# EAGLE design IDS_ADC (EAGLE 9.5.0)
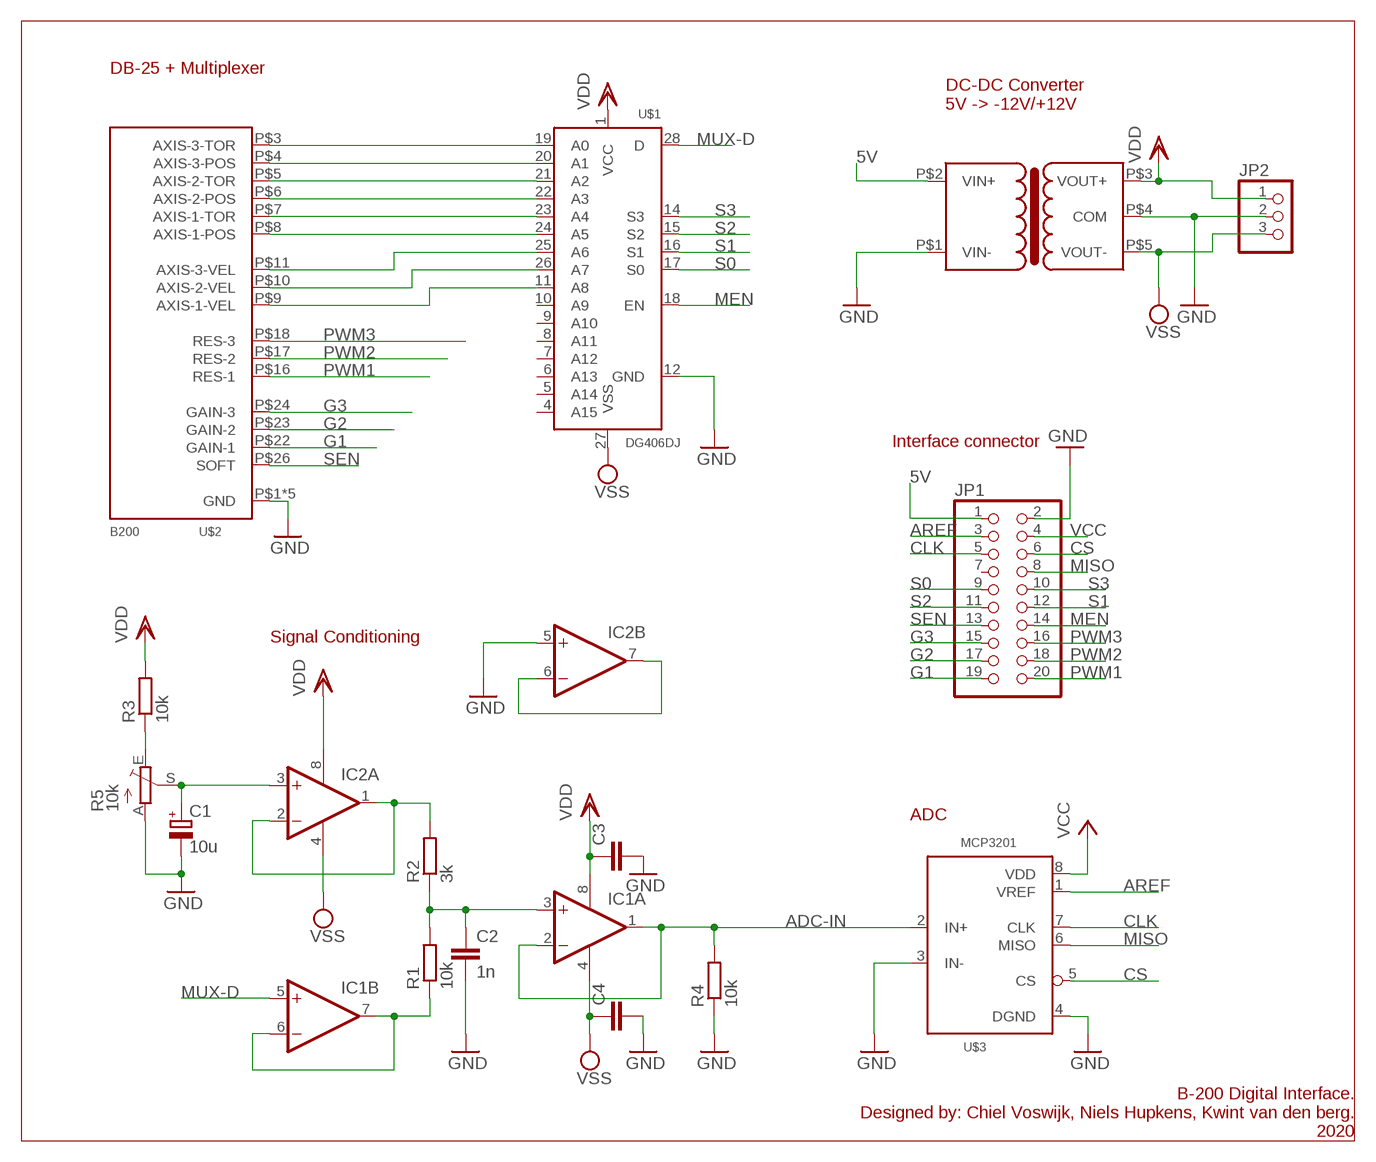
[diagram p0: schematic, sheet 1]

## Parts
C1  10u  CPOL-EUE2.5-7  [E2,5-7]
C2  1n  C-EUC1206  [C1206]
C3  C-EUC1206  [C1206]
C4  C-EUC1206  [C1206]
IC1  NE5532N  [DIL08]
IC2  NE5532N  [DIL08]
JP1  PINHD-2X10  [2X10]
JP2  PINHD-1X3  [1X03]
R1  10k  R-EU_0207/7  [0207/7]
R2  3k  R-EU_0207/7  [0207/7]
R3  10k  R-EU_0207/7  [0207/7]
R4  10k  R-EU_0207/7  [0207/7]
R5  10k  TRIM_EU-RJ9W  [RJ9W]
U$1  DG406DJ  [DIL28-6]
U$2  B200  [PARALLEL]
U$3  MCP3201  [DIL08]
U$4  TRACO-DR-NE  [TRACO-DCDC-SIP6]

## Nets
5V: JP1.1 U$4.P$2(VIN+)
ADC-IN: IC1.1(A:OUT) IC1.2(A:-IN) R4.2 U$3.2(IN+)
AREF: JP1.3 U$3.1(VREF)
CLK: JP1.5 U$3.7(CLK)
CS: JP1.6 U$3.5(CS)
G1: JP1.19 U$2.P$22(GAIN-1)
G2: JP1.17 U$2.P$23(GAIN-2)
G3: JP1.15 U$2.P$24(GAIN-3)
GND: C1.- C2.2 C3.2 C4.2 IC2.5(B:+IN) JP1.2 JP2.2 R4.1 R5.A U$1.12(GND) U$2.P$1(GND) U$2.P$2(GND) U$2.P$19(GND) U$2.P$20(GND) U$2.P$21(GND) U$3.3(IN-) U$3.4(DGND) U$4.P$1(VIN-) U$4.P$4(COM)
MEN: JP1.14 U$1.18(EN)
MISO: JP1.8 U$3.6(MISO)
MUX-D: IC1.5(B:+IN) U$1.28(D)
N$1: IC2.6(B:-IN) IC2.7(B:OUT)
N$2: U$1.19(A0) U$2.P$3(AXIS-3-TOR)
N$3: C2.1 IC1.3(A:+IN) R1.2 R2.1
N$4: U$1.20(A1) U$2.P$4(AXIS-3-POS)
N$5: IC1.6(B:-IN) IC1.7(B:OUT) R1.1
N$6: U$1.21(A2) U$2.P$5(AXIS-2-TOR)
N$7: IC2.1(A:OUT) IC2.2(A:-IN) R2.2
N$8: C1.+ IC2.3(A:+IN) R5.S
N$9: U$1.22(A3) U$2.P$6(AXIS-2-POS)
N$10: U$1.23(A4) U$2.P$7(AXIS-1-TOR)
N$11: U$1.24(A5) U$2.P$8(AXIS-1-POS)
N$12: U$1.25(A6) U$2.P$11(AXIS-3-VEL)
N$13: U$1.26(A7) U$2.P$10(AXIS-2-VEL)
N$14: U$1.11(A8) U$2.P$9(AXIS-1-VEL)
N$15: R3.1 R5.E
PWM1: JP1.20 U$2.P$16(RES-1)
PWM2: JP1.18 U$2.P$17(RES-2)
PWM3: JP1.16 U$2.P$18(RES-3)
S0: JP1.9 U$1.17(S0)
S1: JP1.12 U$1.16(S1)
S2: JP1.11 U$1.15(S2)
S3: JP1.10 U$1.14(S3)
SEN: JP1.13 U$2.P$26(SOFT)
VCC: JP1.4 U$3.8(VDD)
VDD: C3.1 IC1.8(P:V+) IC2.8(P:V+) JP2.1 R3.2 U$1.1(VCC) U$4.P$3(VOUT+)
VSS: C4.1 IC1.4(P:V-) IC2.4(P:V-) JP2.3 U$1.27(VSS) U$4.P$5(VOUT-)
Unconnected: JP1.7 U$1.4(A15) U$1.5(A14) U$1.6(A13) U$1.7(A12) U$1.8(A11) U$1.9(A10) U$1.10(A9)

## Notes on the sheet
- DB-25 + Multiplexer
- DC-DC Converter
  5V -> -12V/+12V
- Interface connector
- Signal Conditioning
- ADC
- B-200 Digital Interface.
  Designed by: Chiel Voswijk, Niels Hupkens, Kwint van den berg.
  2020

## Library data of the parts
C1 = rcl:CPOL-EU: POLARIZED CAPACITOR, European symbol; SPICEPREFIX: C
C2-C4 = rcl:C-EU: CAPACITOR, European symbol; SPICEPREFIX: C
IC1 IC2 = linear:NE5532: AUDIO AMPLIFIER
JP1 = pinhead:PINHD-2X10: PIN HEADER
JP2 = pinhead:PINHD-1X3: PIN HEADER
R1-R4 = rcl:R-EU_: RESISTOR, European symbol; SPICEPREFIX: R
R5 = pot:TRIM_EU-: POTENTIOMETER
U$1 = FHD-Actives:DG406
U$2 = FHD-Connectors:B200
U$3 = FHD-Actives:MCP3201
U$4 = FHD-POWER:TRACO-DR-NE

## Board
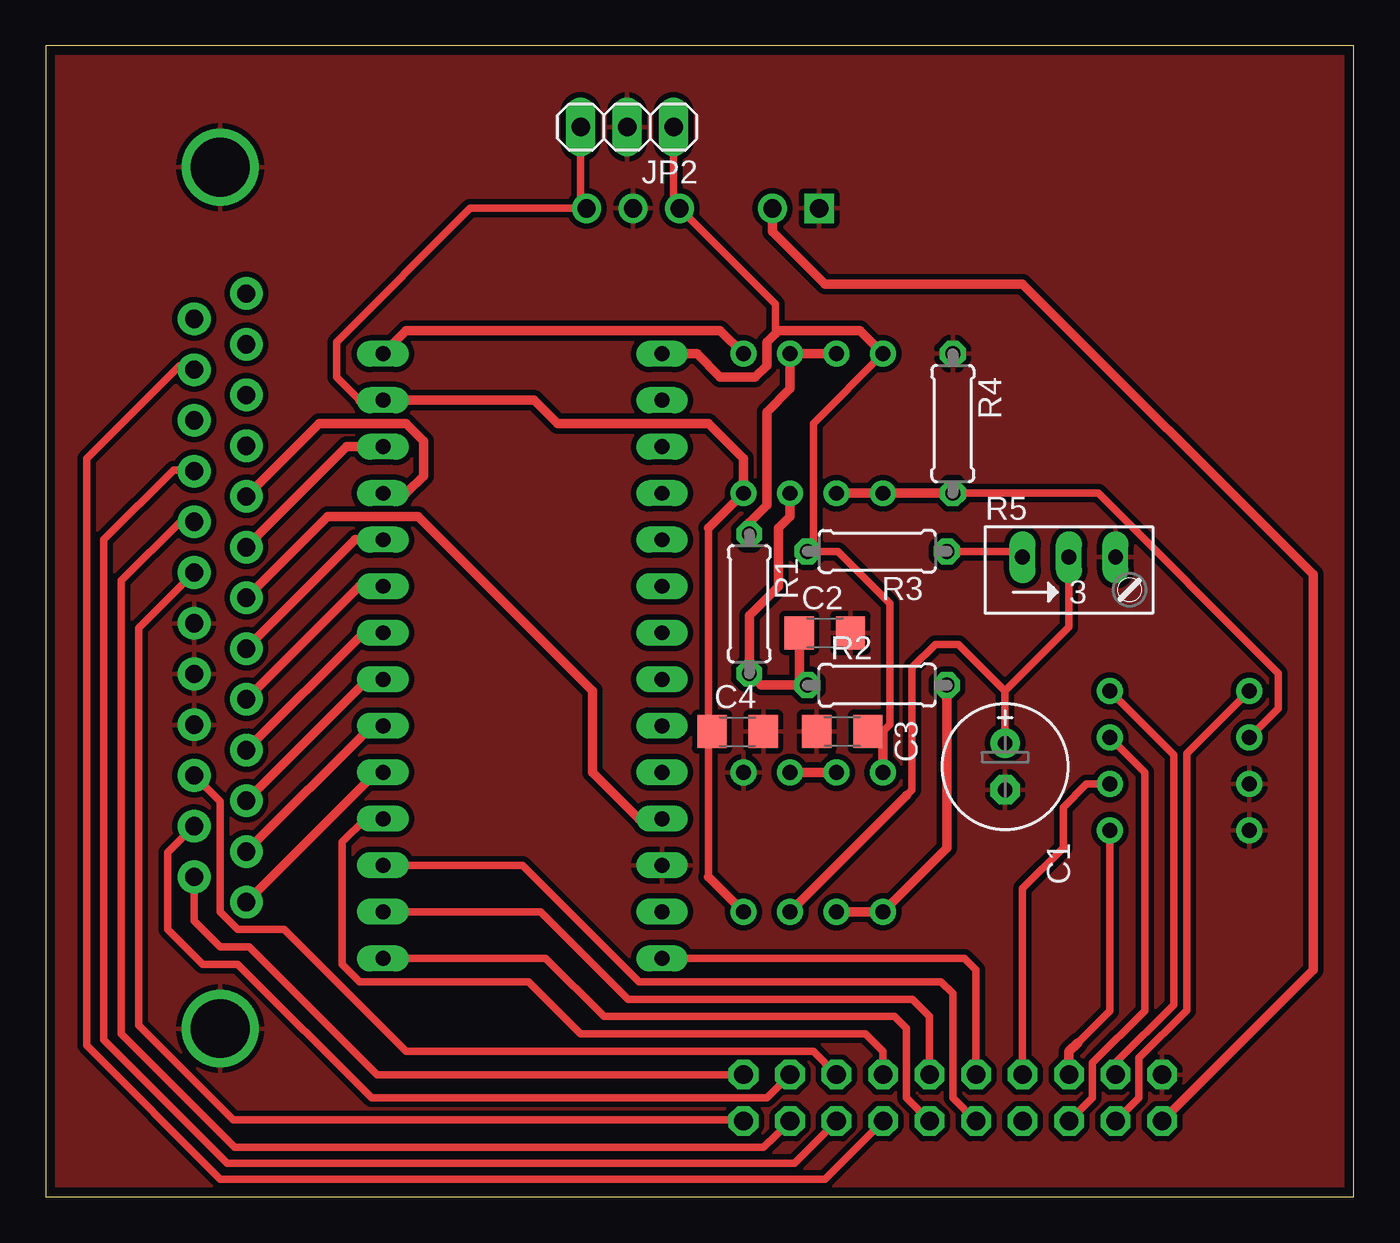
[diagram p1: board, top side]
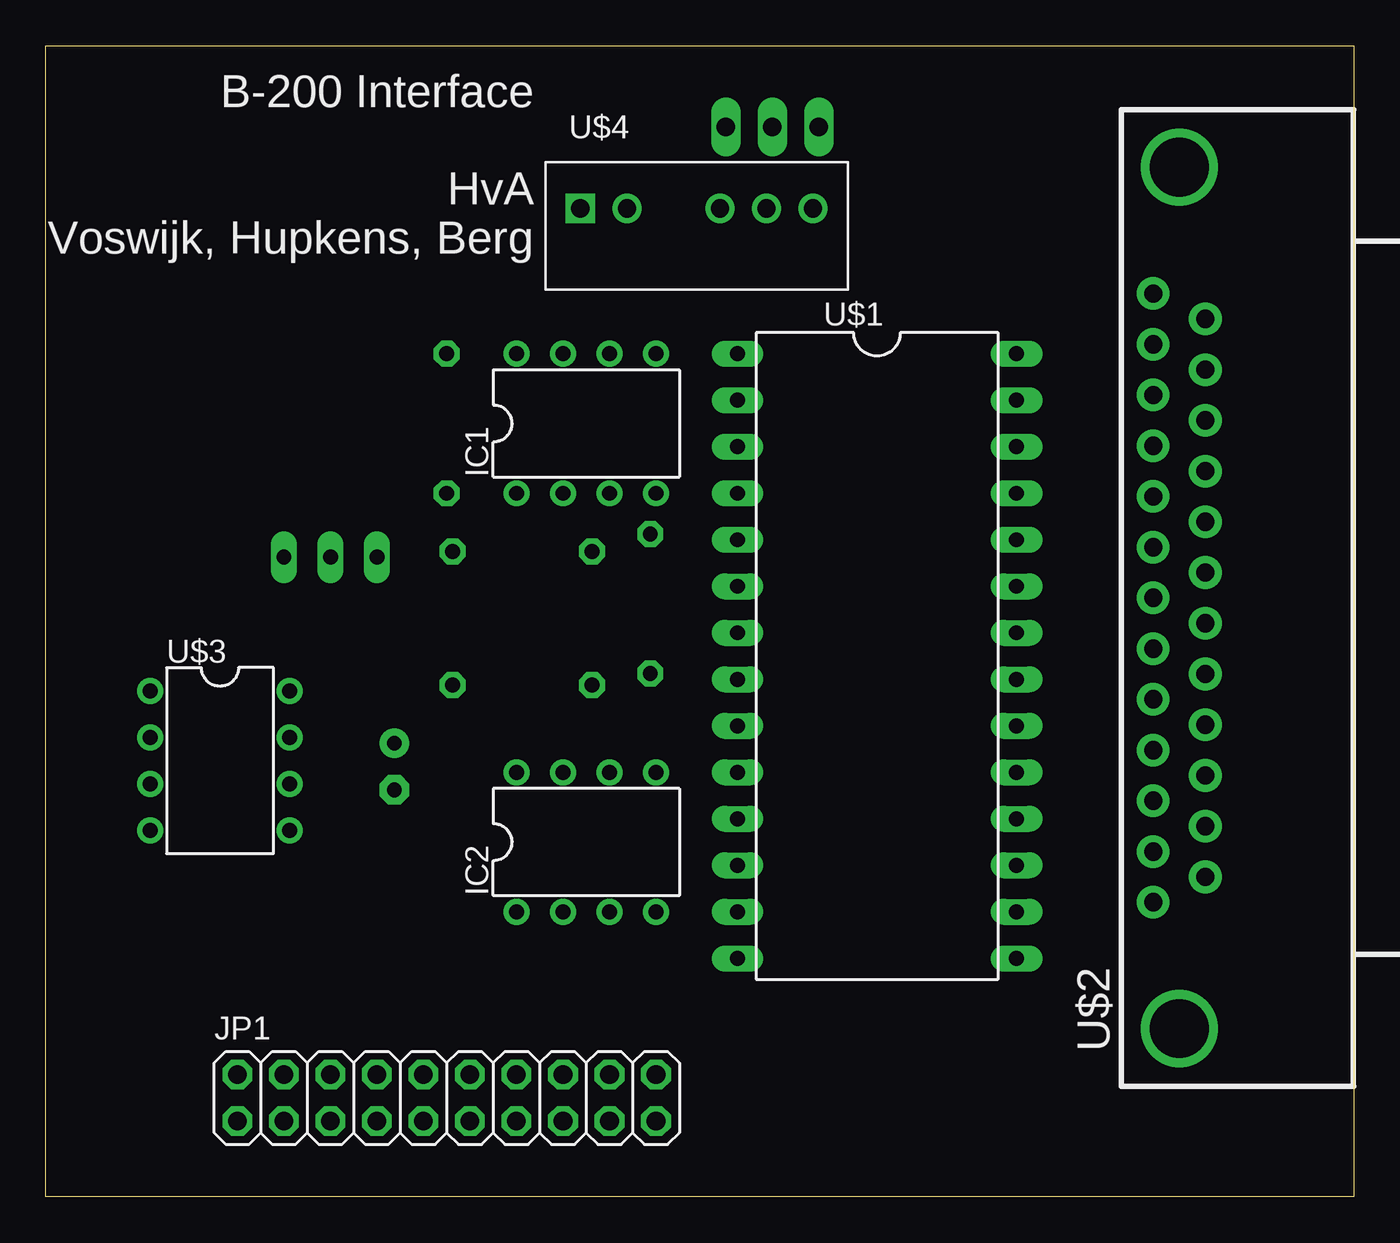
[diagram p2: board, bottom side, seen from below]

Size 71.42 x 62.85 mm. Coordinates in mm from the lower left corner, seen from the top.
Outline: 0,0 71.42,0 71.42,62.85 0,62.85 0,0
Copper layers (1*16): Top 0.035mm / dielectric 1.5mm / Bottom 0.035mm
Design rules "HVA-LPKF": minimum track width 0.3mm, minimum drill 0.6mm, track to track 0.3mm, track to pad 0.3mm, pad to pad 0.3mm, via to via 0.3mm, smd to smd 0.3mm, copper to edge 0.5mm, drill to drill 0.5mm, minimum pad ring 0.3mm, minimum via ring 0.3mm, stop-mask expansion 0.1mm, vias tented up to drill 0mil, thermal gap 0.3mm

### Footprints (pad centres in the part's own frame; a part is rotated, then mirrored left to right if it is on the bottom)
E2,5-7 = drill 0.813 pad 1.6: + -1.27,0 | drill 0.813 pad 1.6 octagon: - 1.27,0
C1206 = smd 1.6 x 1.8: 1 -1.4,0; 2 1.4,0
DIL08 = drill 0.813 pad 1.27: 1 -3.81,-3.81; 2 -1.27,-3.81; 3 1.27,-3.81; 4 3.81,-3.81; 5 3.81,3.81; 6 1.27,3.81; 7 -1.27,3.81; 8 -3.81,3.81
2X10 = drill 1.016 octagon: 1 -11.43,-1.27; 2 -11.43,1.27; 3 -8.89,-1.27; 4 -8.89,1.27; 5 -6.35,-1.27; 6 -6.35,1.27; 7 -3.81,-1.27; 8 -3.81,1.27; 9 -1.27,-1.27; 10 -1.27,1.27; 11 1.27,-1.27; 12 1.27,1.27; 13 3.81,-1.27; 14 3.81,1.27; 15 6.35,-1.27; 16 6.35,1.27; 17 8.89,-1.27; 18 8.89,1.27; 19 11.43,-1.27; 20 11.43,1.27
1X03 = drill 1.016 long: 1 -2.54,0; 2 0,0; 3 2.54,0
0207/7 = drill 0.813 octagon: 1 -3.81,0; 2 3.81,0
RJ9W = drill 0.813 long: A 2.54,0.635; E -2.54,0.635; S 0,0.635
DIL28-6 = drill 0.813 long: 1 -16.51,-7.62; 2 -13.97,-7.62; 3 -11.43,-7.62; 4 -8.89,-7.62; 5 -6.35,-7.62; 6 -3.81,-7.62; 7 -1.27,-7.62; 8 1.27,-7.62; 9 3.81,-7.62; 10 6.35,-7.62; 11 8.89,-7.62; 12 11.43,-7.62; 13 13.97,-7.62; 14 16.51,-7.62; 15 16.51,7.62; 16 13.97,7.62; 17 11.43,7.62; 18 8.89,7.62; 19 6.35,7.62; 20 3.81,7.62; 21 1.27,7.62; 22 -1.27,7.62; 23 -3.81,7.62; 24 -6.35,7.62; 25 -8.89,7.62; 26 -11.43,7.62; 27 -13.97,7.62; 28 -16.51,7.62
PARALLEL = drill 3.2: P$1 -23.52,0; P$2 23.52,0 | drill 1 pad 1.778: P$3 -16.62,1.42; P$4 -13.85,1.42; P$5 -11.08,1.42; P$6 -8.31,1.42; P$7 -5.54,1.42; P$8 -2.77,1.42; P$9 0,1.42; P$10 2.77,1.42; P$11 5.54,1.42; P$12 8.31,1.42; P$13 11.08,1.42; P$14 13.85,1.42; P$15 16.62,1.42; P$16 -15.235,-1.42; P$17 -12.465,-1.42; P$18 -9.695,-1.42; P$19 -6.925,-1.42; P$20 -4.155,-1.42; P$21 -1.385,-1.42; P$22 1.385,-1.42; P$23 4.155,-1.42; P$24 6.925,-1.42; P$25 9.695,-1.42; P$26 12.465,-1.42; P$27 15.235,-1.42
TRACO-DCDC-SIP6 = drill 1 square: P$1 -8.89,1.27 | drill 1: P$2 -6.35,1.27; P$3 -1.27,1.27; P$4 1.27,1.27; P$5 3.81,1.27

### Placement (x,y rotation side)
C1  52.39,23.49 270 top
C2  42.54,30.8 0 top
C3  43.5,25.4 180 top
C4  37.78,25.4 0 top
IC1  41.91,42.23 0 bottom
IC2  41.91,19.37 0 bottom
JP1  49.53,5.4 0 bottom
JP2  31.75,58.42 180 top
R1  38.42,32.38 270 top
R2  45.4,27.94 0 top
R3  45.4,35.24 180 top
R4  49.53,42.23 270 top
R5  55.88,34.29 0 top
U$1  26.04,29.53 270 bottom
U$2  9.53,32.7 90 bottom
U$3  61.91,23.81 270 bottom
U$4  33.34,52.7 0 bottom

### Tracks (layer width: path | path; a pad name or v marks a point on that pad's centre or on a via)
5V
  Top 0.508: JP1.1 69.22,12.38 69.22,33.97 53.34,49.85 42.54,49.85 39.69,52.7 U$4.P$2
ADC-IN
  Top 0.406: R4.2 57.47,38.42 67.31,28.58 67.31,26.67 U$3.2
  Top 0.508: IC1.2 IC1.1 R4.2
AREF
  Top 0.406: JP1.3 59.69,5.4 59.69,7.57 62.3,10.18 62.3,24.2 U$3.1
CLK
  Top 0.406: JP1.5 57.15,5.4 57.15,7.3 60.01,10.16 60.01,23.18 U$3.7
CS
  Top 0.406: 56.36,8.41 58.1,10.16 U$3.5
  Top 0.508: 56.36,8.41 55.88,7.94 JP1.6
G1
  Top 0.406: U$2.P$22 5.08,31.06 5.08,9.36 10.24,4.2 38.02,4.2 JP1.19
G2
  Top 0.406: JP1.17 39.53,3.02 39.2,2.69 10.32,2.69 4.13,8.89 4.13,33.66 7.33,36.86 U$2.P$23
G3
  Top 0.406: JP1.15 40.88,1.83 9.92,1.83 3.18,8.57 3.18,35.88 6.98,39.69 8.04,39.69 U$2.P$24
GND
  pour Top (isolate 0.254): -3.49,-0.64 74.93,-0.64 74.93,65.72 -3.49,65.72
MEN
  Top 0.406: JP1.14 45.72,7.94 44.77,8.89 29.21,8.89 26.35,11.75 17.14,11.75 16.19,12.7 16.19,19.37 17.46,20.64 U$1.18
MISO
  Top 0.406: JP1.8 53.34,16.83 55.56,19.05 55.56,21.27 56.83,22.54 U$3.6
MUX-D
  Top 0.508: IC1.5 36.83,47.31 19.69,47.31 U$1.28
N$1
  Top 0.508: IC2.6 IC2.7
N$2
  Top 0.508: U$2.P$3 18.04,23.18 U$1.19
N$3
  Top 0.508: C2.1 41.14,28.39 R2.1 39.05,27.94 R1.2 38.42,31.75 40,33.34 40,36.51 40.64,37.15 IC1.3
N$4
  Top 0.508: U$2.P$4 17.81,25.72 U$1.20
N$5
  Top 0.508: IC1.7 IC1.6 40.64,44.13 39.37,42.86 39.37,37.78 38.42,36.83 R1.1
N$6
  Top 0.508: U$2.P$5 17.58,28.26 U$1.21
N$7
  Top 0.508: IC2.2 IC2.1 49.21,19.05 R2.2
N$8
  Top 0.406: 46.99,21.91 47.31,22.22 47.31,28.89 48.58,30.16 49.85,30.16 52.39,27.62 | 52.39,27.62 C1.+ | R5.S 55.88,31.11 52.39,27.62
  Top 0.508: 46.99,21.91 IC2.3
N$9
  Top 0.508: U$2.P$6 17.35,30.8 U$1.22
N$10
  Top 0.508: U$2.P$7 17.12,33.34 U$1.23
N$11
  Top 0.508: U$2.P$8 16.89,35.88 U$1.24
N$12
  Top 0.508: U$2.P$11 14.93,42.23 19.69,42.23 20.64,41.28 20.64,39.37 19.69,38.42 U$1.25
N$13
  Top 0.508: U$2.P$10 16.43,40.96 U$1.26
N$14
  Top 0.508: U$2.P$9 15.39,37.15 20.32,37.15 29.85,27.62 29.85,23.18 32.38,20.64 U$1.11
N$15
  Top 0.406: R3.1 53.02,35.24 R5.E
PWM1
  Top 0.406: U$2.P$16 8.1,15.07 9.53,13.65 11.11,13.65 18.1,6.67 JP1.20
PWM2
  Top 0.406: JP1.18 39.37,5.4 17.78,5.4 10.48,12.7 8.57,12.7 6.67,14.61 6.67,18.8 U$2.P$17
PWM3
  Top 0.406: JP1.16 41.91,7.94 19.69,7.94 13.02,14.61 10.48,14.61 9.53,15.56 9.53,21.59 U$2.P$18
S0
  Top 0.406: JP1.9 49.53,5.4 49.53,11.11 48.89,11.75 32.38,11.75 26.04,18.1 U$1.17
S1
  Top 0.406: JP1.12 48.26,9.84 47.33,10.77 31.79,10.77 27.01,15.56 U$1.16
S2
  Top 0.406: JP1.11 46.99,5.4 46.99,9.21 46.35,9.84 30.48,9.84 27.3,13.02 U$1.15
S3
  Top 0.406: U$1.14 50.16,13.02 50.8,12.38 JP1.10
SEN
  Top 0.406: JP1.13 42.54,0.95 9.53,0.95 2.22,8.26 2.22,40.32 7.3,45.4 7.87,45.4 U$2.P$26
VCC
  Top 0.406: JP1.4 58.42,7.3 61.59,10.48 61.59,24.13 U$3.8
VDD
  Top 0.3: C3.1 45.72,25.4
  Top 0.406: 45.72,25.4 46.1,25.78 46.1,32.38 43.25,35.24 R3.2 41.91,35.56 41.91,42.23 IC1.8 | 39.85,47.15 39.85,48.74 U$4.P$3 34.29,54.29 JP2.1
  Top 0.508: IC2.8 45.72,25.4 | U$1.1 35.56,46.04 36.83,44.77 38.73,44.77 39.37,45.4 39.37,46.67 39.85,47.15 40,47.31 44.45,47.31 IC1.8
VSS
  Top 0.406: 17.14,43.5 15.87,44.77 15.87,46.67 23.18,53.98 U$4.P$5 29.21,54.29 JP2.3 | 36.2,17.46 36.2,25.21 C4.1 36.2,25.59 36.2,36.51
  Top 0.508: IC2.4 36.2,17.46 | 36.2,36.51 IC1.4 38.1,40.32 36.2,42.23 27.94,42.23 26.67,43.5 U$1.27 17.14,43.5

### Text on the board
bNames: B-200 Interface / / HvA / Voswijk, Hupkens, Berg